# Altium schematic sheet Fans.SchDoc: Fans
size Letter; DocumentNumber: 10; SheetNumber: 10; SheetTotal: 11
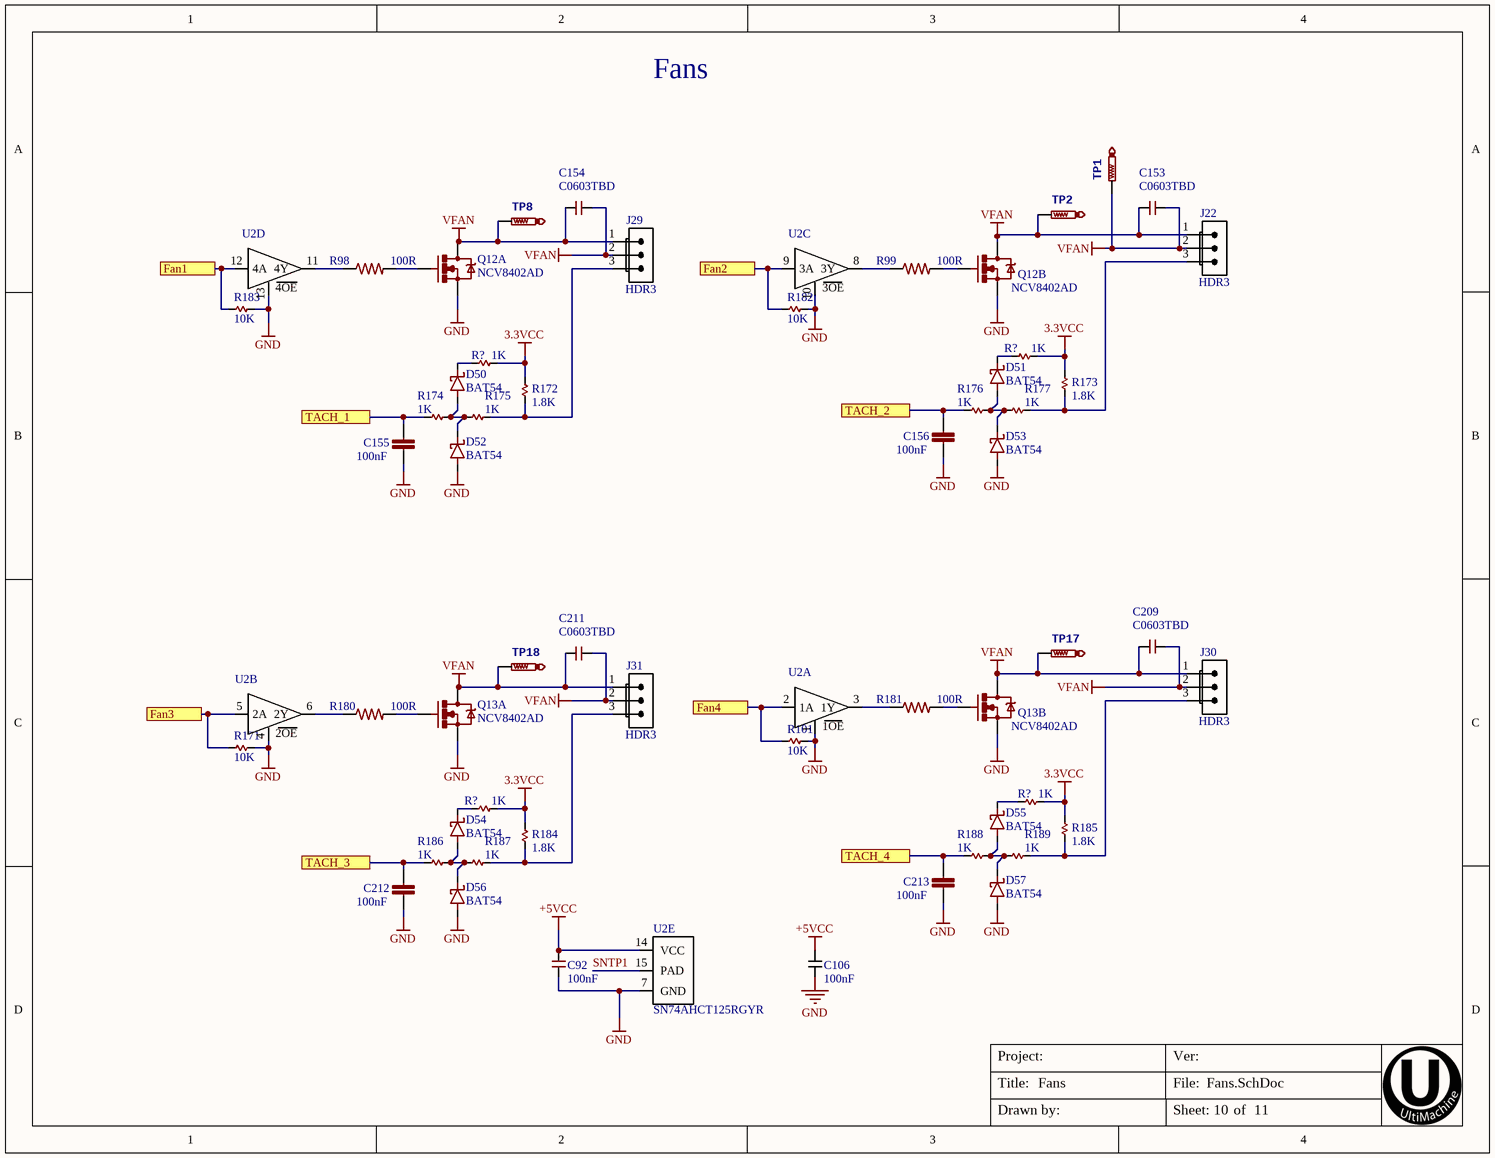
[diagram p0: Fans.SchDoc]

## Parts
(Parts that share a designator on the sheet are numbered #1, #2 ... from top to bottom, then left to right.)
C92  100nF  [C0402]
C106  100nF  [C0201 Large Pads]
C153  C0603TBD  [C0603]
C154  C0603TBD  [C0603]
C155  100nF  [C0402]
C156  100nF  [C0402]
C209  C0603TBD  [C0603]
C211  C0603TBD  [C0603]
C212  100nF  [C0402]
C213  100nF  [C0402]
D50  BAT54  [SOD523_IPC]
D51  BAT54  [SOD523_IPC]
D52  BAT54  [SOD523_IPC]
D53  BAT54  [SOD523_IPC]
D54  BAT54  [SOD523_IPC]
D55  BAT54  [SOD523_IPC]
D56  BAT54  [SOD523_IPC]
D57  BAT54  [SOD523_IPC]
J22  value HDR3  [70543-02 PIN-IN-PASTE]  (hidden comment: Molex 70543-03)
J29  value HDR3  [70543-02 PIN-IN-PASTE]  (hidden comment: Molex 70543-03)
J30  value HDR3  [70543-02 PIN-IN-PASTE]  (hidden comment: Molex 70543-03)
J31  value HDR3  [70543-02 PIN-IN-PASTE]  (hidden comment: Molex 70543-03)
Q12  NCV8402AD  [NCV8402AD-SOIC8]  (parts A,B of 2)
Q13  NCV8402AD  [NCV8402AD-SOIC8]  (parts A,B of 2)
R98  100R  [R0402]
R99  100R  [R0402]
R101  10K  [R0402]
R171  10K  [R0402]
R172  1.8K  [R0402]
R173  1.8K  [R0402]
R174  1K  [R0402]
R175  1K  [R0402]
R176  1K  [R0402]
R177  1K  [R0402]
R180  100R  [R0402]
R181  100R  [R0402]
R182  10K  [R0402]
R183  10K  [R0402]
R184  1.8K  [R0402]
R185  1.8K  [R0402]
R186  1K  [R0402]
R187  1K  [R0402]
R188  1K  [R0402]
R189  1K  [R0402]
R?#1  1K  [R0402]
R?#2  1K  [R0402]
R?#3  1K  [R0402]
R?#4  1K  [R0402]
TP1  TestPoint  [TP1-27]  (value not drawn)  (no BOM)
TP2  TestPoint  [TP1-27]  (value not drawn)  (no BOM)
TP8  TestPoint  [TP1-27]  (value not drawn)  (no BOM)
TP17  TestPoint  [TP1-27]  (value not drawn)  (no BOM)
TP18  TestPoint  [TP1-27]  (value not drawn)  (no BOM)
U2  SN74AHCT125RGYR  [QFN50P350X350X100_RGY_S-PVQFN-N14]  (value not drawn)  (parts A,B,C,D,E of 5)

## Ports
Fan1, Fan2, Fan3, Fan4, TACH_1, TACH_2, TACH_3, TACH_4

## Nets
3.3VCC: R172.2 R173.2 R184.2 R185.2 R?#1.2 R?#2.2 R?#3.2 R?#4.2
+5VCC: C92.2 C106.2 U2.14(VCC)
GND: C92.1 C106.1 C155.2 C156.2 C212.2 C213.2 D52.A D56.A D57.A Q12.1(S) Q12.3(S) Q13.1(S) Q13.3(S) R101.2 R171.2 R182.2 R183.2 U2.1(1OE) U2.4(2OE) U2.7(GND) U2.10(3OE) U2.13(4OE)
VFAN: C153.1 C153.2 C154.1 C154.2 C209.1 C209.2 C211.1 C211.2 J22.1(S) J22.2(S) J29.1(S) J29.2(S) J30.1(S) J30.2(S) J31.1(S) J31.2(S) Q12.5(D) Q12.7(D) Q13.5(D) Q13.7(D) TP1.TP TP2.TP TP8.TP TP17.TP TP18.TP
Fan1: R183.1 U2.12(4A) ; port Fan1
Fan2: R182.1 U2.9(3A) ; port Fan2
Fan3: R171.1 U2.5(2A) ; port Fan3
Fan4: R101.1 U2.2(1A) ; port Fan4
SNTP1: U2.15(PAD)
TACH_1: C155.1 R174.1 ; port TACH_1
TACH_2: C156.1 R176.1 ; port TACH_2
TACH_3: C212.1 R186.1 ; port TACH_3
TACH_4: C213.1 R188.1 ; port TACH_4
NetD50_A: D50.A D52.K R174.2 R175.1
NetD50_K: D50.K R?#2.1
NetD51_A: D51.A D53.K R176.2 R177.1
NetD51_K: D51.K R?#1.1
NetD54_A: D54.A D56.K R186.2 R187.1
NetD54_K: D54.K R?#4.1
NetD55_A: D55.A D57.K R188.2 R189.1
NetD55_K: D55.K R?#3.1
NetJ22_3: J22.3(S) R173.1 R177.2
NetJ29_3: J29.3(S) R172.1 R175.2
NetJ30_3: J30.3(S) R185.1 R189.2
NetJ31_3: J31.3(S) R184.1 R187.2
NetQ12_2: Q12.2(G) R98.2
NetQ12_4: Q12.4(G) R99.2
NetQ13_2: Q13.2(G) R180.2
NetQ13_4: Q13.4(G) R181.2
NetR98_1: R98.1 U2.11(4Y)
NetR99_1: R99.1 U2.8(3Y)
NetR180_1: R180.1 U2.6(2Y)
NetR181_1: R181.1 U2.3(1Y)

Not connected (* = marked no-connect by the designer): D53 A

## Notes on the sheet
- Labels drawn without touching a wire or pin: GND
- Title:
- Project:
- File:
- Ver:
- Drawn by:
- Sheet:
- of

## Library data of the parts
C92 = 100nF 0402 16V X7R: CAP CER 0402 100nF 16V 10% X7R; MANUFACTURER: Murata; MANUFACTURER #: GRM155R71C104KA88D; PART DESCRIPTION: 0.10µF ±10% 16V Ceramic Capacitor X7R 0402 (1005 Metric); VALUE: 100nF; DISTRIBUTOR #: 490-3261-2-ND; DISTRIBUTOR: Digikey; PART: GRM155R71C104KA88D; TOLERANCE: 10%; EE_SPEC: 16V
C106 = 100nF 6.3V X5R 0201: CAP CER 0.1UF 6.3V 10% X5R 0201; PART: CL03A104KQ3NNNC; MANUFACTURER: Samsung; MANUFACTURER #: CL03A104KQ3NNNC; DISTRIBUTOR: DIGI-KEY; DISTRIBUTOR #: 1276-1013-1-ND; TOLERANCE: 10%; VOLTAGE: 6.3V
C153 C154 C209 C211 = C0603TBD: Capacitor Non Polarized; MANUFACTURER #: DNI-C0603TBD; VALUE: C0603TBD; DNI: DNI; PART: DNI-C0603TBD
C155 C156 C212 C213 = GRM155R71C104KA88D: CAP CER 0402 100nF 16V 10% X7R; Manufacturer: Murata; Part Description: 0.10µF ±10% 16V Ceramic Capacitor X7R 0402 (1005 Metric); EE_SPEC: 100nF 16V X7R 0402; Tolerance: +/- 10%; VALUE: 100nF; MANUFACTURER #: GRM155R71C104KA88D; DISTRIBUTOR #: 490-3261-2-ND; DISTRIBUTOR: Digi-Key; PART: GRM155R71C104KA88D
D50-D57 = BAT54WX: DIODE SCHOTTKY 30V 200MA SOD523; MANUFACTURER: Diodes Incorporated; MANUFACTURER #: BAT54WX-TP; PART DESCRIPTION: Diode Schottky 30V 200mA (DC) Surface Mount SOD-523; TOLERANCE: -NA-; VALUE: BAT54; DISTRIBUTOR #: BAT54WX-TPTR-ND; DISTRIBUTOR: Digikey; EE_SPEC: 30V 200mA; PART: BAT54WX-TP
J22 J29-J31 = CONN 3POS VERT 0.1" SHRD LOCKING PIP: 3 Positions Header, Shrouded Connector 0.100" (2.54mm) Through Hole Gold - Pin in Paste; MANUFACTURER #: 0705430002; TOLERANCE: -NA-; MANUFACTURER: Molex; DISTRIBUTOR #: WM4801-ND; DISTRIBUTOR: Digikey; PART: 0705430002; PART DESCRIPTION: 3 Positions Header, Shrouded Connector 0.100" (2.54mm) Through Hole Gold; EE_SPEC: -NA-
R98 R99 R180 R181 = RES 100R 0402 1%: RES SMD 100 OHM 1% 1/16W 0402; MANUFACTURER: Yageo; MANUFACTURER #: RC0402FR-07100RL; PART DESCRIPTION: 100 Ohm ±1% 0.063W, 1/16W Chip Resistor 0402 (1005 Metric) Moisture Resistant Thick Film; EE_SPEC: 100R 1% 0402; VALUE: 100R; DISTRIBUTOR #: 311-100LRTR-ND; DISTRIBUTOR: Digi-Key; PART: RC0402FR-07100RL; TOLERANCE: 1%
R101 R171 R182 R183 = 10k 1% 0402: RES SMD 10K OHM 1% 1/16W 0402; MANUFACTURER: Yageo; MANUFACTURER #: RC0402FR-0710KP; PART DESCRIPTION: 10k Ohm ±1% 0.063W, 1/16W Chip Resistor 0402 (1005 Metric) Moisture Resistant Thick Film; VALUE: 10K; DISTRIBUTOR #: YAG1249TR-ND; DISTRIBUTOR: Digikey; EE_SPEC: 1/16W; PART: RC0402FR-0710KP; TOLERANCE: 1%
R172 R173 R184 R185 = RC0402FR-071K8L: RES SMD 1.8K OHM 1% 1/16W 0402; Manufacturer: Yageo; Part Description: 1.8k Ohm ±1% 0.063W, 1/16W Chip Resistor 0402 (1005 Metric) Moisture Resistant Thick Film; EE_SPEC: 1.8k 1% 0402; Tolerance: +/- 1%; VALUE: 1.8K; MANUFACTURER #: RC0402FR-071K8L; DISTRIBUTOR #: 311-1.80KLRTR-ND; DISTRIBUTOR: Digi-Key; PART: RC0402FR-071K8L
R174-R177 R186-R189 R?#1-R?#4 = RC0402FR-071KL: RES SMD 1K OHM 1% 1/16W 0402; Manufacturer: Yageo; Part Description: 1k Ohm ±1% 0.063W, 1/16W Chip Resistor 0402 (1005 Metric) Moisture Resistant Thick Film; EE_SPEC: 1k 1% 0402; Tolerance: +/- 1%; VALUE: 1K; MANUFACTURER #: RC0402FR-071KL; DISTRIBUTOR #: 311-1.00KLRTR-ND; DISTRIBUTOR: Digi-Key; PART: RC0402FR-071KL
TP1 TP2 TP8 TP17 TP18 = TestPoint: Test Point
U2 = SN74AHCT125: Quadruple Bus Buffer Gates With 3-State Outputs 14-VQFN -40 to 125; MANUFACTURER: Texas Instruments; PART DESCRIPTION: Buffer, Non-Inverting 4 Element 1 Bit per Element Push-Pull Output 14-VQFN (3.5x3.5); TOLERANCE: -NA-; VALUE: Tri-State Buffer; EE_SPEC: 5V 8mA; MANUFACTURER #: SN74AHCT125RGYR; DISTRIBUTOR #: 296-13910-2-ND; DISTRIBUTOR: Digikey; PART: SN74AHCT125RGYR